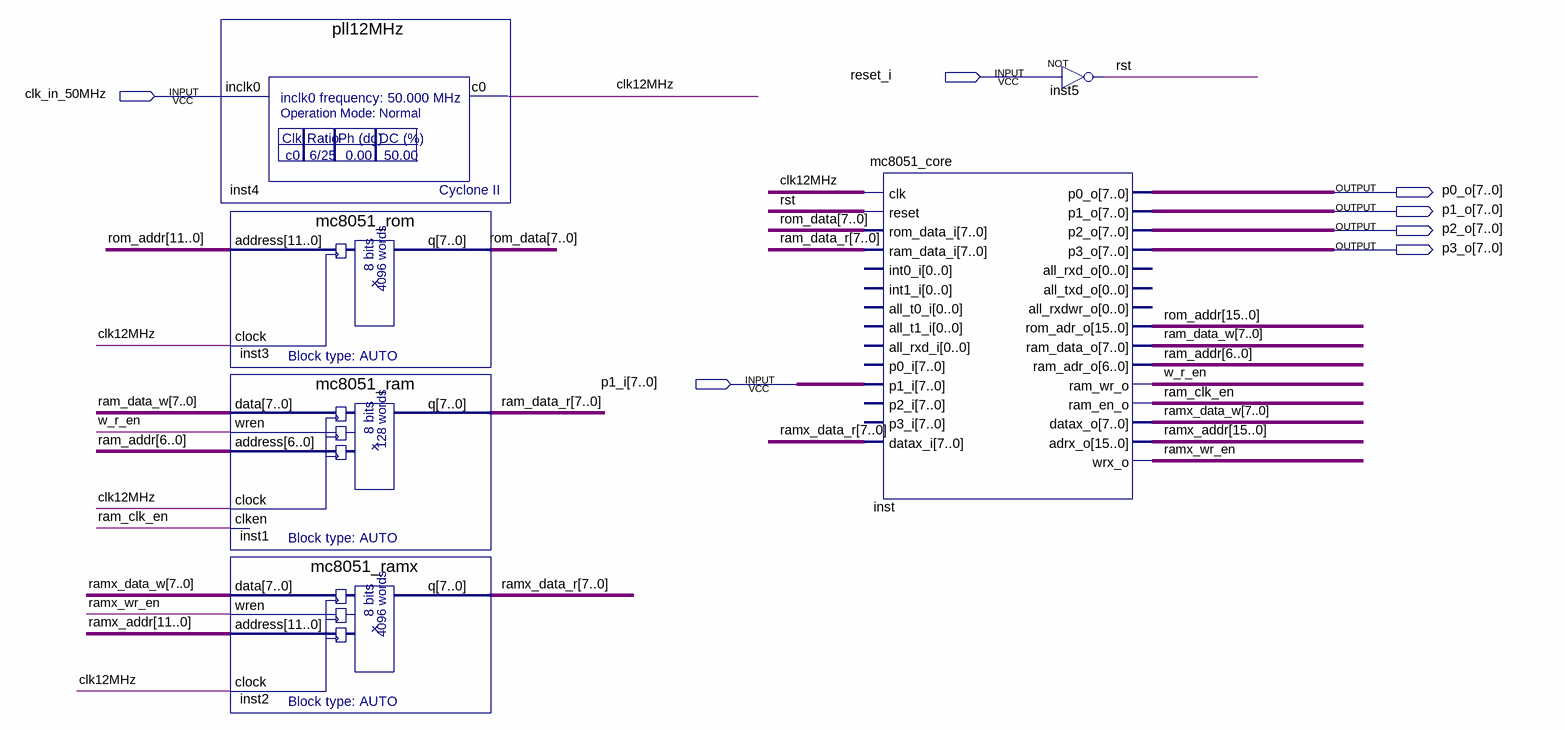
[diagram p0: schematic sheet]
// Quartus schematic embeded_system.bdf as structural Verilog: 6 symbols, 7 pins
module embeded_system (
  input  reset_i,
  input  clk_in_50MHz,
  input  [7:0] p1_i,
  output [7:0] p0_o,
  output [7:0] p1_o,
  output [7:0] p2_o,
  output [7:0] p3_o
);

  wire clk12MHz, ram_clk_en, ramx_wr_en, rst, w_r_en;
  wire [6:0] ram_addr;
  wire [7:0] ram_data_r, ram_data_w, ramx_data_r, ramx_data_w, rom_data;
  wire [15:0] ramx_addr, rom_addr;

  pll12MHz inst4 (.inclk0(clk_in_50MHz), .c0(clk12MHz));
  mc8051_rom inst3 (.address(rom_addr[11:0]), .clock(clk12MHz), .q(rom_data));
  mc8051_ram inst1 (
    .data(ram_data_w), .wren(w_r_en), .address(ram_addr), .clock(clk12MHz), .clken(ram_clk_en), .q(ram_data_r));
  mc8051_ramx inst2 (
    .data(ramx_data_w), .wren(ramx_wr_en), .address(ramx_addr[11:0]), .clock(clk12MHz), .q(ramx_data_r));
  mc8051_core inst (
    .clk(clk12MHz), .reset(rst), .rom_data_i(rom_data), .ram_data_i(ram_data_r), .p1_i(p1_i),
    .datax_i(ramx_data_r), .p0_o(p0_o), .p1_o(p1_o), .p2_o(p2_o), .p3_o(p3_o), .rom_adr_o(rom_addr),
    .ram_data_o(ram_data_w), .ram_adr_o(ram_addr), .ram_wr_o(w_r_en), .ram_en_o(ram_clk_en),
    .datax_o(ramx_data_w), .adrx_o(ramx_addr), .wrx_o(ramx_wr_en));  // open: int0_i, int1_i, all_t0_i, all_t1_i, all_rxd_i, p0_i, p2_i, p3_i, all_rxd_o, all_txd_o, all_rxdwr_o
  not inst5 (rst, reset_i);
endmodule
